# Altium schematic sheet CAN.SchDoc: Sample Sheet Title
size B; Date: MM/DD/YYYY; Author: Sample Author; Organization: ORGANIZATION; Address1: ADDRESS 1; Address2: ADDRESS 2; Address3: ADDRESS 3; Address4: ADDRESS 4; Revision: -; SheetNumber: 1; SheetTotal: 4; ENG_APP_DATE: --/--/--; DSN_APP_DATE: --/--/--; CHK_APP_DATE: --/--/--
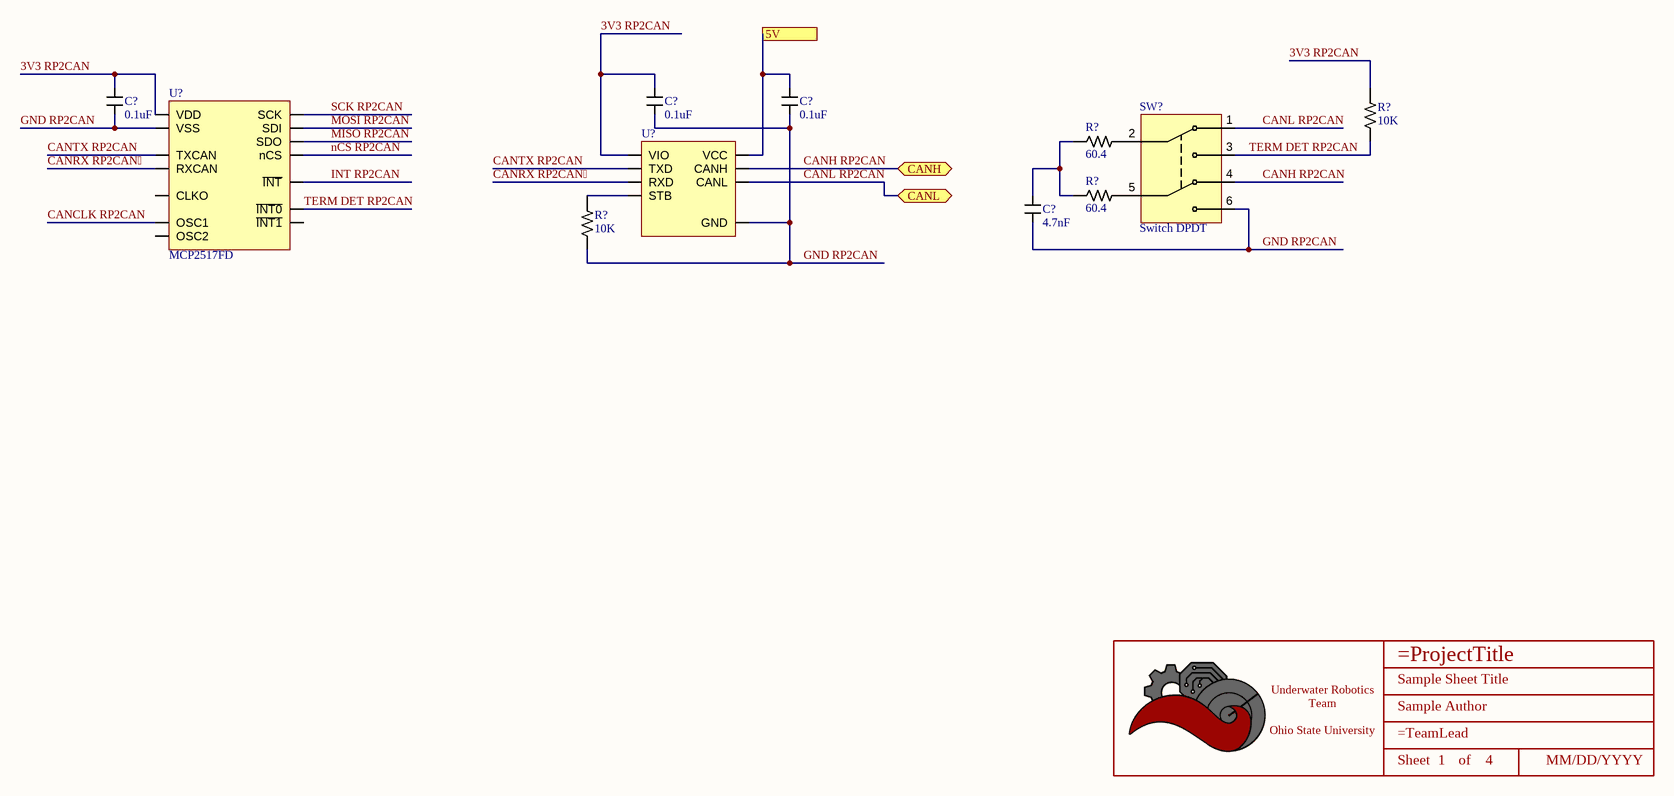
[diagram p0: CAN.SchDoc]

## Parts
(Parts that share a designator on the sheet are numbered #1, #2 ... from top to bottom, then left to right.)
*  Title_Block  [LOGO]  (value not drawn)  (graphical)
C?#1  value 0.1uF  [CAPACITOR_0603]  (hidden comment: 100nF Ceramic 25V)
C?#2  value 0.1uF  [CAPACITOR_0603]  (hidden comment: 100nF Ceramic 25V)
C?#3  value 0.1uF  [CAPACITOR_0603]  (hidden comment: 100nF Ceramic 25V)
C?#4  value 4.7nF  [CAPACITOR_0402]  (hidden comment: 4700pF Ceramic 25V)
R?#1  Value  (Ohms): 10K  [RESISTOR_0402]  (hidden comment: 10k Ohm 1% 1/16W)
R?#2  Value  (Ohms): 60.4  [RESISTOR_0402]  (hidden comment: 60.4 Ohm 1% 1/16W)
R?#3  Value  (Ohms): 60.4  [RESISTOR_0402]  (hidden comment: 60.4 Ohm 1% 1/16W)
R?#4  Value  (Ohms): 10K  [RESISTOR_0402]  (hidden comment: 10k Ohm 1% 1/16W)
SW?  Switch DPDT  [CAS-220TA]
U?#1  CAN Transceiver  [SOIC-8]  (value not drawn)
U?#2  MCP2517FD  [SOIC-14]

## Ports
5V, CANH (bidir), CANL (bidir)

## Nets
3V3 RP2CAN: C?#1.1 C?#2.1 R?#1.1 U?#1.5(VIO) U?#2.14(VDD)
5V: C?#3.1 U?#1.3(VCC) ; port 5V
CANCLK RP2CAN: U?#2.6(OSC1)
CANH RP2CAN: SW?.4 U?#1.7(CANH) ; port CANH
CANL RP2CAN: SW?.1 U?#1.6(CANL) ; port CANL
CANRX RP2CAN: U?#1.4(RXD) U?#2.2(RXCAN)
CANTX RP2CAN: U?#1.1(TXD) U?#2.1(TXCAN)
GND RP2CAN: C?#1.2 C?#2.2 C?#3.2 C?#4.2 R?#4.2 SW?.6 U?#1.2(GND) U?#2.7(VSS)
INT RP2CAN: U?#2.4(~{INT})
MISO RP2CAN: U?#2.12(SDO)
MOSI RP2CAN: U?#2.11(SDI)
nCS RP2CAN: U?#2.13(nCS)
SCK RP2CAN: U?#2.10(SCK)
TERM DET RP2CAN: R?#1.2 SW?.3 U?#2.9(~{INT0})
NetC?#4_1: C?#4.1 R?#2.2 R?#3.2
NetR?#2_1: R?#2.1 SW?.2
NetR?#3_1: R?#3.1 SW?.5
NetR?#4_1: R?#4.1 U?#1.8(STB)

Not connected (* = marked no-connect by the designer): U?#2 3(CLKO) 5(OSC2) 8(~{INT1})

## Notes on the sheet
- DWG. NO.
- REV.
- SHT.
- THIS DOCUMENT AND THE DATA DISCLOSED HEREIN OR HEREWITH IS THE PROPERTY OF ALTIUM LIMITED AND MAY BE FREELY DISTRIBUTED IN WHOLE. NO RIGHTS ARE RESERVED OR EXPRESS OR IMPLIED WARANTEE GIVEN.
- REVISION
- DESCRIPTION
- DATE
- APPROVED
- ENG:
- APPROVALS
- PROJECT
- DSN:
- CHK:
- REFERENCE DOCUMENTS
- PROJECT REVISION:
- TITLE
- DOCUMENT REVISION:
- DESIGN ITEM:
- BOM:
- FAB DWG:
- PCB DWG:
- ASSY DWG:
- SCALE:
- SIZE
- B
- CAGE CODE
- FILE NAME
- DWG NO.
- SHEET
- OF
- REV
- (in symbol Title_Block) Underwater Robotics Team / Ohio State University; Sheet; of

## Library data of the parts
* = Title_Block: UWRT Schematic Title Block Template / Created June 2021, Dylan Trainor
C?#1-C?#3 = CAPACITOR_0.1uF_0603_25V: Cap 100nF 25V +/-10% / Ceramic 0603; Voltage: 6.3V; Made By: Flip B; ComponentLink1Description: Datsheet; ComponentLink1URL: https://www.mouser.com/datasheet/2/212/KEM_C1002_X7R_SMD-1102033.pdf; Tolerance: +/- 10%; Supplier 1: Digikey; Supplier Part Number 1: 1276-1006-1-ND
C?#4 = CAPACITOR_0.0047uF_0402: 4700 pF +/-10% 25V Ceramic Capacitor X7R 0402; Made By: Robert Pafford; Tolerance: +/- 10%; Voltage: 25V; Supplier 1: Future Electronics; Supplier Part Number 1: 1909415
R?#1 R?#4 = RESISTOR_10K_0402: RES 10k OHM 1% 1/16W 0402; Tolerance: +/- 1%; Made By: Robert Pafford; Wattage: 1/16W; Supplier: Digikey; Digikey Part Numer: CR0603-JW-104ELFTR-ND; Supplier 1: Digi-Key; Supplier Part Number 1: YAG3436CT-ND
R?#2 R?#3 = RESISTOR_60.4_0402: RES 60.4 OHM 1% 1/16W 0402; Tolerance: +/- 1%; Made By: Robert Pafford; Wattage: 1/16W; Supplier: Digikey; Digikey Part Numer: CR0603-JW-104ELFTR-ND; Supplier 1: Digi-Key; Supplier Part Number 1: 13-AC0402FR-0760R4LCT-ND
SW? = CAS-220TA_CAN_TERM: GOLD SWITCH FLUSH SLIDE DPDT 100MA 6V; Made By: Robert Pafford; Voltage Rating: 6VDC; Current Rating: 100 mA; Switch Function: DPDT; Contact Finish: Gold; Supplier 1: Digi-Key; Supplier Part Number 1: CAS220JCT-ND
U?#1 = TJA1442AT: CAN Interface IC High-Speed CAN Transceiver with Standby Mode; Made By: Robert Pafford; Max Data Rate: 5Mbps; Supplier 1: Mouser; Supplier Part Number 1: 771-TJA1442AT/0Z
U?#2 = MCP2517FD: CANbus Controller CAN 2.0 SPI Interface 14-SOIC; Made By: Robert Pafford; Max FD Rate: 8 Mbps